# EAGLE design adsb_2e_smd (EAGLE 5.10)
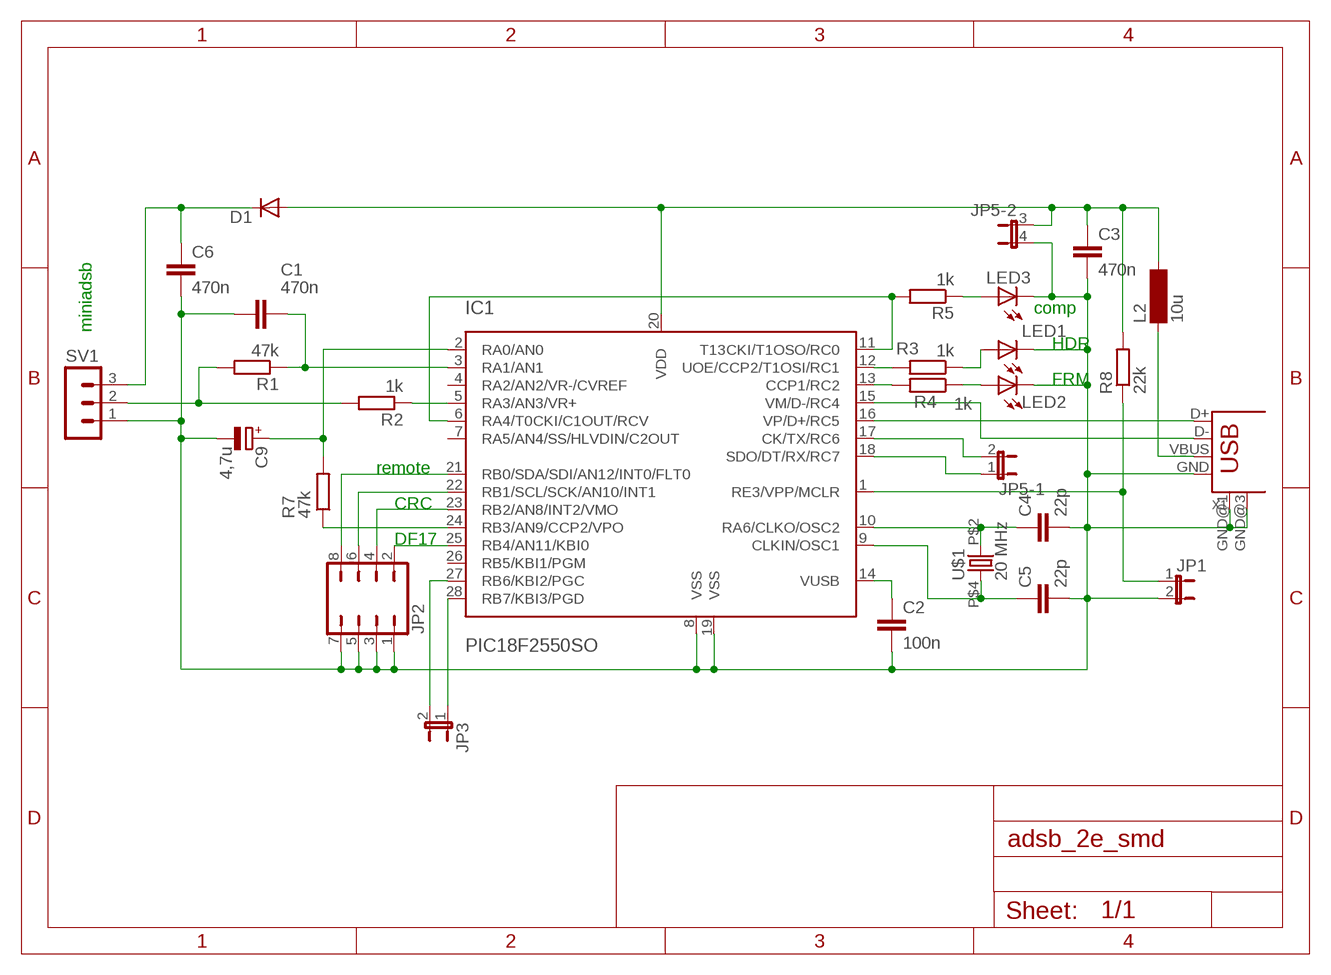
[diagram p0: schematic, sheet 1]

## Parts
C1  470n  C-EUC1206  [C1206]
C2  100n  C-EUC1206  [C1206]
C3  470n  C-EUC1206  [C1206]
C4  22p  C-EUC1206  [C1206]
C5  22p  C-EUC1206  [C1206]
C6  470n  C-EUC1206  [C1206]
C9  4,7u  CPOL-EUCT6032  [CT6032]
D1  DIODE-MINIMELF  [MINIMELF]
IC1  PIC18F2550SO  [SO-28W]
JP1  JP1E  [JP1]
JP2  JP4Q  [JP4Q]
JP3  JP1E  [JP1]
JP5  JP2QE  [JP2Q]
L2  10u  SM-1206  [SM-1206]
LED1  LEDCHIPLED_1206  [CHIPLED_1206]
LED2  LEDCHIPLED_1206  [CHIPLED_1206]
LED3  LEDCHIPLED_1206  [CHIPLED_1206]
R1  47k  R-EU_M1206  [M1206]
R2  1k  R-EU_M1206  [M1206]
R3  1k  R-EU_M1206  [M1206]
R4  1k  R-EU_M1206  [M1206]
R5  1k  R-EU_M1206  [M1206]
R7  47k  R-EU_M1206  [M1206]
R8  22k  R-EU_M1206  [M1206]
SV1  MA03-1  [MA03-1]
U$1  20 MHz  CRYSTAL_MT  [MT]
X1  USB-MB-S  [USB-MB-S]

## Nets
N$1: IC1.23(RB2/AN8/INT2/VMO) JP2.4
N$2: LED3.A R5.1
N$3: L2.1 X1.VBUS
N$4: C9.+ IC1.2(RA0/AN0) R7.2
N$5: IC1.16(VP/D+/RC5) X1.D+
N$6: IC1.15(VM/D-/RC4) X1.D-
N$7: IC1.6(RA4/T0CKI/C1OUT/RCV) IC1.11(T13CKI/T1OSO/RC0) R5.2
N$8: IC1.24(RB3/AN9/CCP2/VPO) R7.1
N$9: IC1.5(RA3/AN3/VR+) R2.1
N$10: C1.1 IC1.3(RA1/AN1) R1.1
N$11: C5.1 IC1.9(CLKIN/OSC1) U$1.P$4
N$12: C4.1 IC1.10(RA6/CLKO/OSC2) U$1.P$2
N$13: IC1.25(RB4/AN11/KBI0) JP2.2
N$14: R1.2 R2.2 SV1.2
N$15: C6.1 D1.C SV1.3
N$16: IC1.21(RB0/SDA/SDI/AN12/INT0/FLT0) JP2.8
N$17: IC1.12(UOE/CCP2/T1OSI/RC1) R3.2
N$18: IC1.13(CCP1/RC2) R4.2
N$19: LED1.A R3.1
N$20: LED2.A R4.1
N$21: IC1.22(RB1/SCL/SCK/AN10/INT1) JP2.6
N$22: IC1.1(RE3/VPP/MCLR) JP1.1 R8.1
N$23: IC1.28(RB7/KBI3/PGD) JP3.1
N$24: IC1.27(RB6/KBI2/PGC) JP3.2
N$25: IC1.17(CK/TX/RC6) JP5.2
N$26: IC1.18(SDO/DT/RX/RC7) JP5.1
VDD: C3.1 D1.A IC1.20(VDD) JP5.3 L2.2 R8.2
VSS: C1.2 C2.2 C3.2 C4.2 C5.2 C6.2 C9.- IC1.8(VSS) IC1.19(VSS) JP1.2 JP2.1 JP2.3 JP2.5 JP2.7 JP5.4 LED1.C LED2.C LED3.C SV1.1 X1.GND X1.GND@1(GND) X1.GND@3(GND)
VUSB: C2.1 IC1.14(VUSB)
Unconnected: IC1.4(RA2/AN2/VR-/CVREF) IC1.7(RA5/AN4/SS/HLVDIN/C2OUT) IC1.26(RB5/KBI1/PGM)

## Notes on the sheet
- comp
- miniadsb
- HDR
- FRM
- remote
- CRC
- DF17

## Library data of the parts
C1-C6 = rcl:C-EU: CAPACITOR, European symbol
C9 = rcl:CPOL-EU: POLARIZED CAPACITOR, European symbol
D1 = diode:DIODE-: DIODE
IC1 = microchip-dspic:PIC18F2550: PIC18F Flash Microcontroller with USB port
JP1 JP3 = jumper:JP1E: JUMPER
JP2 = jumper:JP4Q: JUMPER
JP5 = jumper:JP2QE: JUMPER
L2 = inductor-neosid:SM-1206: INDUCTOR SMD chip inductor
LED1-LED3 = led:LED: LED OSRAM: - CHIPLED LG R971, LG N971, LY N971, LG Q971, LY Q971, LO R971, LY R971 LH N974, LH R974 LS Q976, LO Q976, LY Q976 LO Q996 - Hyper CHIPLED LW Q18S LB Q993, LB Q99A, LB R99A - SideLED LS A670, LO A670, LY A670, LG A670, LP A670 LB A673, LV A673, LT A673, LW A673 LH A674 LY A675 LS A676, LA A676, LO A676, LY A676, LW A676 LS A679, LY A679, LG A679 - Hyper Micro SIDELED® LS Y876, LA Y876, LO Y876, LY Y876 LT Y87S - SmartLED LW L88C, LW L88S LB L89C, LB L89S, LG L890 LS L89K, LO L89K, LY L89K LS L896, LA L896, LO L896, LY L896 - TOPLED LS T670, LO T670, LY T670, LG T670, LP T670 LSG T670, LSP T670, LSY T670, LOP T670, LYG T670 LG T671, LOG T671, LSG T671 LB T673, LV T673, LT T673, LW T673 LH T674 LS T676, LA T676, LO T676, LY T676, LB T676, LH T676, LSB T676, LW T676 LB T67C, LV T67C, LT T67C, LS T67K, LO T67K, LY T67K, LW E67C LS E67B, LA E67B, LO E67B, LY E67B, LB E67C, LV E67C, LT E67C LW T67C LS T679, LY T679, LG T679 LS T770, LO T770, LY T770, LG T770, LP T770 LB T773, LV T773, LT T773, LW T773 LH T774 LS E675, LA E675, LY E675, LS T675 LS T776, LA T776, LO T776, LY T776, LB T776 LHGB T686 LT T68C, LB T68C - Hyper Mini TOPLED® LB M676 - Mini TOPLED Santana® LG M470 LS M47K, LO M47K, LY M47K Source: http://www.osram.convergy.de LUXEON: - LUMILED® LXK2-PW12-R00, LXK2-PW12-S00, LXK2-PW14-U00, LXK2-PW14-V00 LXK2-PM12-R00, LXK2-PM12-S00, LXK2-PM14-U00 LXK2-PE12-Q00, LXK2-PE12-R00, LXK2-PE12-S00, LXK2-PE14-T00, LXK2-PE14-U00 LXK2-PB12-K00, LXK2-PB12-L00, LXK2-PB12-M00, LXK2-PB14-N00, LXK2-PB14-P00, LXK2-PB14-Q00 LXK2-PR12-L00, LXK2-PR12-M00, LXK2-PR14-Q00, LXK2-PR14-R00 LXK2-PD12-Q00, LXK2-PD12-R00, LXK2-PD12-S00 LXK2-PH12-R00, LXK2-PH12-S00 LXK2-PL12-P00, LXK2-PL12-Q00, LXK2-PL12-R00 Source: www.luxeon.com KINGBRIGHT: KA-3528ASYC Source: www.kingbright.com
R1-R5 R7 R8 = rcl:R-EU_: RESISTOR, European symbol
SV1 = con-lstb:MA03-1: PIN HEADER
U$1 = sprut:CRYSTAL_MT: CRYSTAL MT SMD crystal 3.2 x 2.5 x 0.7 mm EuroQuartz
X1 = con-usb-2:USB: USB Connectors

## Board
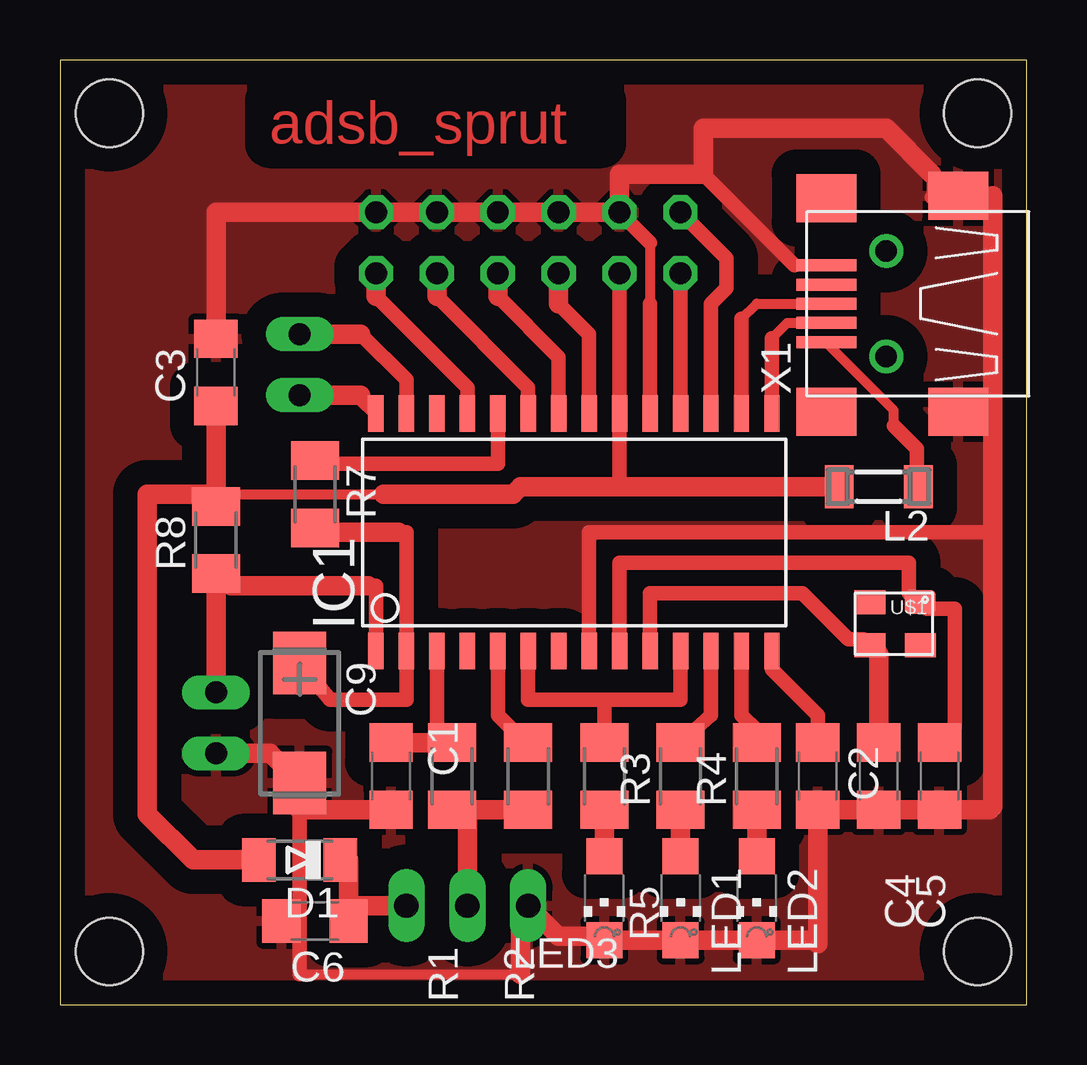
[diagram p1: board, top side]
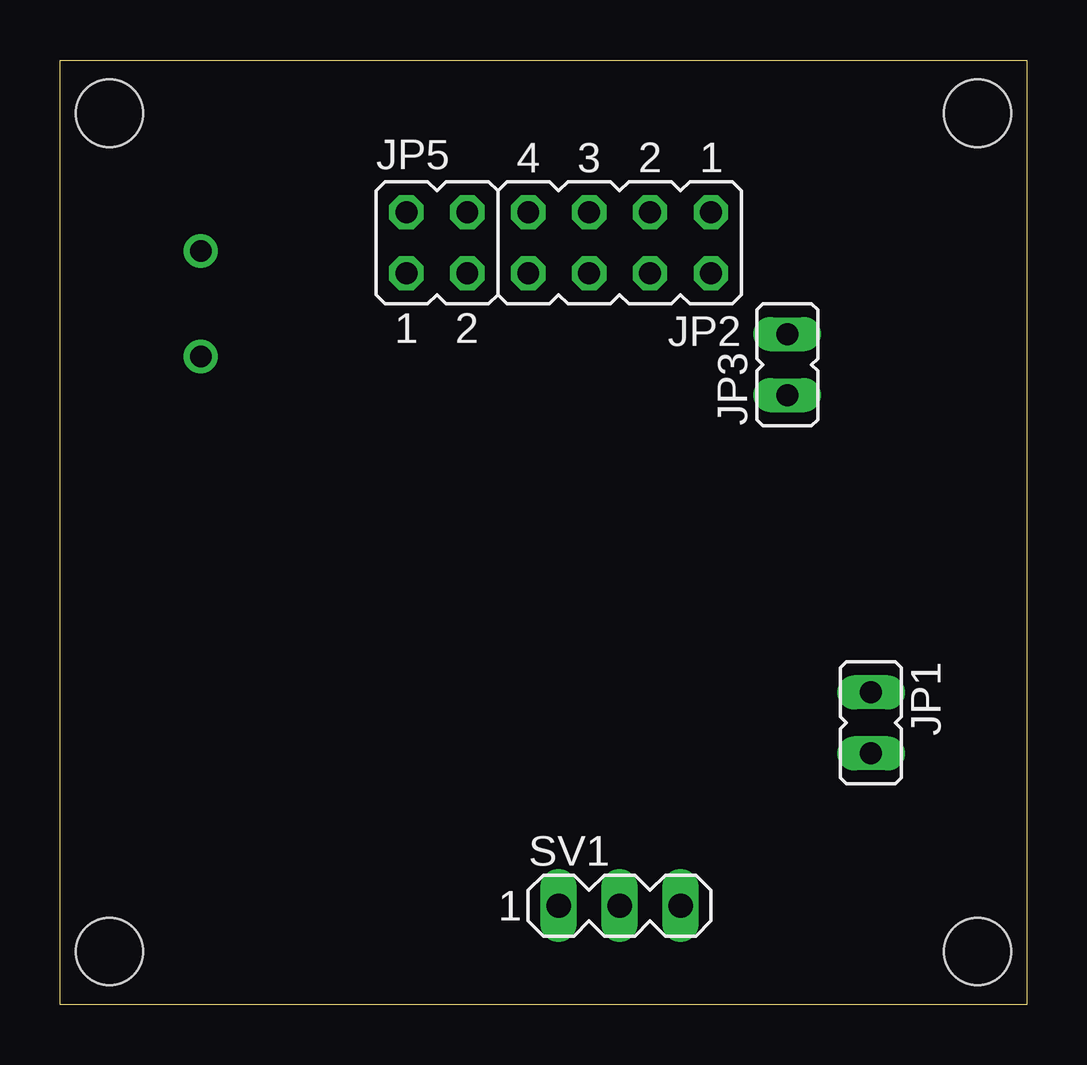
[diagram p2: board, bottom side, seen from below]

Size 40.31 x 39.36 mm. Coordinates in mm from the lower left corner, seen from the top.
Outline: 0,0 40.31,0 40.31,39.36 0,39.36 0,0
Copper layers (1*16): Top 0.035mm / dielectric 1.5mm / Bottom 0.035mm
Design rules "default *": minimum track width 10mil, minimum drill 12mil, track to track 8mil, track to pad 8mil, pad to pad 8mil, via to via 8mil, smd to smd 8mil, copper to edge 40mil, drill to drill 8mil, minimum pad ring 10mil, minimum via ring 8mil, stop-mask expansion 4mil, vias tented up to drill 0mil, thermal gap 10mil
Holes 2.8 mm at 2.06,37.14 2.06,2.22 38.25,2.22 38.25,37.14

### Footprints (pad centres in the part's own frame; a part is rotated, then mirrored left to right if it is on the bottom)
C1206 = smd 1.6 x 1.8: 1 -1.4,0; 2 1.4,0
CT6032 = smd 2.6 x 2.2: + -2.5,0; - 2.5,0
MINIMELF = smd 1.4 x 1.8: A 1.7,0; C -1.7,0
SO-28W = smd 0.635 x 1.524: 1 -7.62,-4.953; 2 -6.35,-4.953; 3 -5.08,-4.953; 4 -3.81,-4.953; 5 -2.54,-4.953; 6 -1.27,-4.953; 7 0,-4.953; 8 1.27,-4.953; 9 2.54,-4.953; 10 3.81,-4.953; 11 5.08,-4.953; 12 6.35,-4.953; 13 7.62,-4.953; 14 8.89,-4.953; 15 8.89,4.953; 16 7.62,4.953; 17 6.35,4.953; 18 5.08,4.953; 19 3.81,4.953; 20 2.54,4.953; 21 1.27,4.953; 22 0,4.953; 23 -1.27,4.953; 24 -2.54,4.953; 25 -3.81,4.953; 26 -5.08,4.953; 27 -6.35,4.953; 28 -7.62,4.953
JP1 = drill 0.914 long: 1 0,-1.27; 2 0,1.27
JP4Q = drill 0.914 octagon: 1 -3.81,-1.27; 2 -3.81,1.27; 3 -1.27,-1.27; 4 -1.27,1.27; 5 1.27,-1.27; 6 1.27,1.27; 7 3.81,-1.27; 8 3.81,1.27
JP2Q = drill 0.914 octagon: 1 -1.27,-1.27; 2 -1.27,1.27; 3 1.27,-1.27; 4 1.27,1.27
SM-1206 = smd 1.2 x 1.8: 1 -1.65,0; 2 1.65,0
CHIPLED_1206 = smd 1.5 x 1.5: A 0,-1.75; C 0,1.75
M1206 = smd 1.6 x 2: 1 -1.4,0; 2 1.4,0
MA03-1 = drill 1.016 long: 1 -2.54,0; 2 0,0; 3 2.54,0
MT = smd 1.3 x 1: P$1 -1.1,0.9; P$2 1,0.9; P$3 1,-0.9; P$4 -1.1,-0.9
USB-MB-S = smd 2.5 x 0.5: D+ 2.5,0; D- 2.5,0.8; GND 2.5,-1.6; ID 2.5,-0.8; VBUS 2.5,1.6 | smd 2.5 x 2: GND@1 -3,4.5; GND@2 2.5,4.5; GND@3 -3,-4.5; GND@4 2.5,-4.4 | drill 0.9 round: P$5 0,2.2; P$6 0,-2.2

### Placement (x,y rotation side)
C1  13.8,9.52 270 top
C2  31.59,9.52 270 top
C3  6.5,26.35 90 top
C4  34.12,9.52 270 top
C5  36.67,9.52 270 top
C6  10.63,3.49 180 top
C9  10,11.74 270 top
D1  10,6.03 180 top
IC1  20.79,19.68 0 top
JP1  6.5,11.74 180 bottom
JP2  16.98,31.74 180 bottom
JP3  10,26.66 0 bottom
JP5  24.6,31.74 0 bottom
L2  34.12,21.59 180 top
LED1  25.87,4.44 180 top
LED2  29.05,4.44 180 top
LED3  22.7,4.44 180 top
R1  16.35,9.52 270 top
R2  19.52,9.52 270 top
R3  25.87,9.52 90 top
R4  29.05,9.52 90 top
R5  22.7,9.52 90 top
R7  10.63,21.27 270 top
R8  6.5,19.36 90 top
SV1  16.98,4.12 0 bottom
U$1  34.76,15.87 180 top
X1  34.44,29.2 180 top

### Tracks (layer width: path | path; a pad name or v marks a point on that pad's centre or on a via)
N$1
  Top 0.61: IC1.23 19.52,25.71 15.71,29.52
  Top 0.813: 15.71,29.52 JP2.4
N$2
  Top 0.813: LED3.A R5.1
N$3
  Top 0.406: 34.76,24.12 34.76,24.76 31.94,27.58 X1.VBUS | L2.1 35.71,21.33
  Top 0.61: 34.76,24.12 35.71,23.17 35.71,21.33
N$4
  Top 0.406: 10.63,19.68 R7.2
  Top 0.61: C9.+ 11.27,12.7 14.44,12.7 IC1.2 14.44,19.36 | 14.44,19.36 14.44,19.05 | 14.44,19.36 14.44,19.68 14.12,19.68
  Top 0.813: 14.12,19.68 10.63,19.68
N$5
  Top 0.406: X1.D+ 29.05,29.2 28.41,28.57
  Top 0.61: IC1.16 28.41,28.57
N$6
  Top 0.406: X1.D- 30.32,28.41 29.68,27.77
  Top 0.61: IC1.15 29.68,27.77
N$7
  Top 0.406: IC1.11 25.87,14.6
  Top 0.61: IC1.6 19.52,12.7 22.7,12.7 | IC1.11 25.87,12.7 22.7,12.7 | R5.2 22.7,12.7
N$8
  Top 0.61: R7.1 10.5,22.67 10.95,22.54 18.25,22.54 IC1.24
N$9
  Top 0.406: R2.1 19.52,10.79
  Top 0.61: 19.52,10.79 18.25,12.06 IC1.5
N$10
  Top 0.406: R1.1 15.71,10.79 15.84,10.92 R1.1
  Top 0.61: 15.71,10.79 IC1.3
  Top 0.813: C1.1 R1.1
N$11
  Top 0.406: IC1.9 23.33,14.6 | 37.3,11.55 C5.1 | 35.39,17.14 35.49,17.14 U$1.P$4 36.12,16.51
  Top 0.61: IC1.9 23.33,18.41 35.39,18.41 35.39,17.14 | 37.3,11.55 37.3,16.51 36.12,16.51
N$12
  Top 0.406: 33.5,15.23 U$1.P$2 34.12,14.6
  Top 0.61: IC1.10 24.6,17.14 30.95,17.14 32.86,15.23 33.5,15.23
  Top 0.813: 34.12,14.6 C4.1
N$13
  Top 0.61: IC1.25 16.98,25.71 13.17,29.52
  Top 0.813: 13.17,29.52 JP2.2
N$14
  Top 0.406: 16.98,7.93 16.79,8.12 R1.2
  Top 0.813: SV1.2 16.98,7.93 | R1.2 R2.2
N$15
  Top 0.406: 12.03,6.03 D1.C | 11.9,4.12 11.9,3.8 12.03,3.8 C6.1
  Top 0.813: C6.1 12.03,6.03 | 11.9,4.12 SV1.3
N$16
  Top 0.61: IC1.21 22.06,27.94 20.79,29.2
  Top 0.813: 20.79,29.2 JP2.8
N$17
  Top 0.61: R3.2 27.14,12.06 IC1.12
N$18
  Top 0.406: R4.2 29.05,11.42
  Top 0.61: IC1.13 28.41,12.06 29.05,11.42
N$19
  Top 0.813: LED1.A R3.1
N$20
  Top 0.813: LED2.A R4.1
N$21
  Top 0.61: 18.25,29.52 20.79,26.98 IC1.22
  Top 0.813: 18.25,29.52 JP2.6
N$22
  Top 0.61: 12.85,17.46 13.17,17.46 13.17,17.14 IC1.1 | 6.5,17.33 6.63,17.46 7.14,17.46 R8.1
  Top 0.813: JP1.1 6.5,17.33 | 7.14,17.46 12.85,17.46
N$23
  Top 0.406: 12.54,25.4 12.54,25.27
  Top 0.61: 12.54,25.27 IC1.28
  Top 0.813: JP3.1 12.54,25.4
N$24
  Top 0.61: 12.54,27.94 14.44,26.03 IC1.27
  Top 0.813: JP3.2 12.54,27.94
N$25
  Top 0.61: IC1.17 27.14,29.2 27.78,29.84 27.78,31.11 JP5.2
N$26
  Top 0.61: IC1.18 JP5.1
VDD
  Top 0.406: 23.33,21.59 JP5.3 | 7.27,21.27 13.49,21.27 | 6.5,21.27 R8.2
  Top 0.61: JP5.3 IC1.20 23.33,21.59 | R8.2 7.27,21.27
  Top 0.813: L2.2 23.33,21.59 19.2,21.59 18.89,21.27 13.49,21.27 | C3.1 6.5,21.27 3.65,21.27 3.65,7.93 5.55,6.03 D1.A
VSS
  Top 0.406: LED1.C 25.87,2.54 25.72,2.69 | LED2.C 29.05,2.54 28.89,2.69 | 31.43,2.69 31.59,2.54 | C2.2 31.59,8.25 | 22.7,2.85 LED3.C | 33.68,8.12 33.81,8.25 33.81,8.12 C4.2 34.12,8.25 34.26,8.12 | C5.2 36.67,8.25 36.53,8.12 | 10,1.27 19.2,1.27 | C9.- 10,8.12 | 10,3.49 C6.2 | 24.6,31.74 24.6,29.2 | 30.62,30.8 X1.GND | 38.89,24.7 X1.GND@1 | 38.89,33.7 X1.GND@3 | 36.35,33.65 36.35,34.6
  Top 0.61: 38.76,8.12 38.89,8.25 | IC1.8 22.06,19.68 38.89,19.68 | 19.2,3.8 SV1.1 | C9.- 10,3.49 10,1.27 | 24.6,29.2 IC1.19 | 26.82,34.6 30.62,30.8 | JP5.4 24.6,31.74 | 38.89,33.65 36.35,33.65
  Top 0.813: LED3.C 25.72,2.69 | LED1.C 28.89,2.69 | LED2.C 31.43,2.69 | 31.59,2.54 C2.2 33.68,8.12 | SV1.1 20.79,2.85 22.7,2.85 | 38.76,8.12 36.53,8.12 34.26,8.12 | 38.89,8.25 38.89,19.68 38.89,24.7 38.89,33.65 38.89,33.7 | 19.2,1.27 19.2,3.8 | 10,8.12 C1.2 | 36.35,34.6 34.44,36.51 26.82,36.51 26.82,34.6 23.33,34.6 JP5.4 JP2.7 JP2.5 JP2.3 JP2.1 6.5,33.02 C3.2 | JP1.2 8.77,10.47 C9.-
  pour Top (isolate 1.016): 41.11,40 41.11,-0.64 -0.8,-0.64 -0.8,40
VUSB
  Top 0.406: C2.1 31.59,10.79
  Top 0.61: IC1.14 29.68,13.97 31.59,12.06 C2.1

### Text on the board
Top: adsb_sprut